# Altium schematic sheet BIG.SchDoc
size A
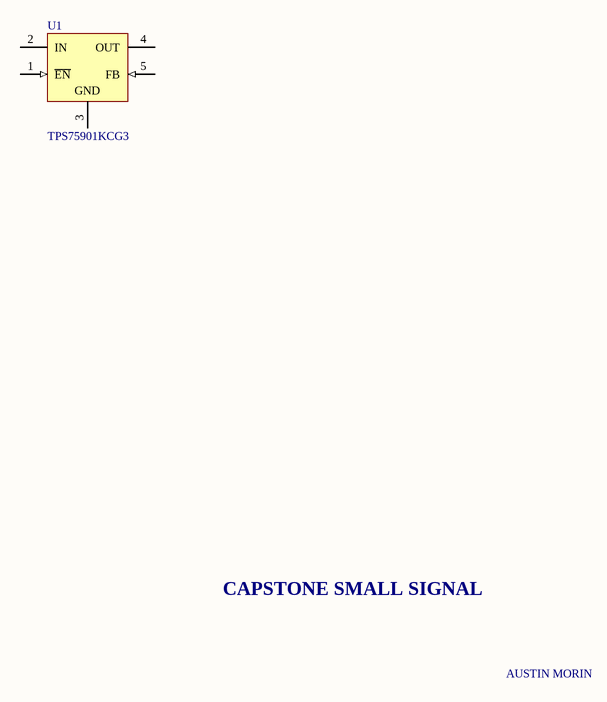
[diagram p0: BIG.SchDoc]

## Parts
U1  TPS75901KCG3  [TI-KC5]

## Nets

Not connected (* = marked no-connect by the designer): U1 1(~{EN}) 2(IN) 3(GND) 4(OUT) 5(FB)

## Notes on the sheet
- CAPSTONE SMALL SIGNAL
- AUSTIN MORIN

## Library data of the parts
U1 = CMP-0395-00732-1: Single Output Fast Transient Response LDO, 7.5 A, Adjustable 1.22 to 5 V Output, 2.8 to 5.5 V Input, 5-pin TO-220 (KC), -40 to 125 degC, Green (RoHS & no Sb/Br); Manufacturer: Texas Instruments; Vout Adj(Min)(V): 1.22; Vdo(Typ)(mV): 400; Power Good: TRUE; Vout Adj(Max)(V): 5; Iq(Typ)(mA): 0.12; Vin(Min)(V): 2.8; Accuracy(%): 3; SubFamily: Single Channel LDO; Iout(Max)(A): 7.5; Vin(Max)(V): 5.5; ComponentLink2URL: http://www.ti.com/general/docs/lit/getliterature.tsp?genericPartNumber=TPS75901&fileType=pdf; ComponentLink3URL: http://www.ti.com/litv/pdf/msot008c; PackageDescription: 5-Pin Plastic Flange Mount; Eco-Plan: Green (RoHS & no Sb/Br); PackageReference: KC5; Mounting Technology: Through Hole; ComponentLink2Description: Datasheet; ComponentLink3Description: Package Specification; PartNumber: TPS75901KCG3; DatasheetVersion: SLVS318E; ComponentLink1Description: Manufacturer URL; PackageVersion: 4040208/F; ComponentLink1URL: http://www.ti.com/